# Altium project Z693_Test_JK08_V1.0.PrjPCB
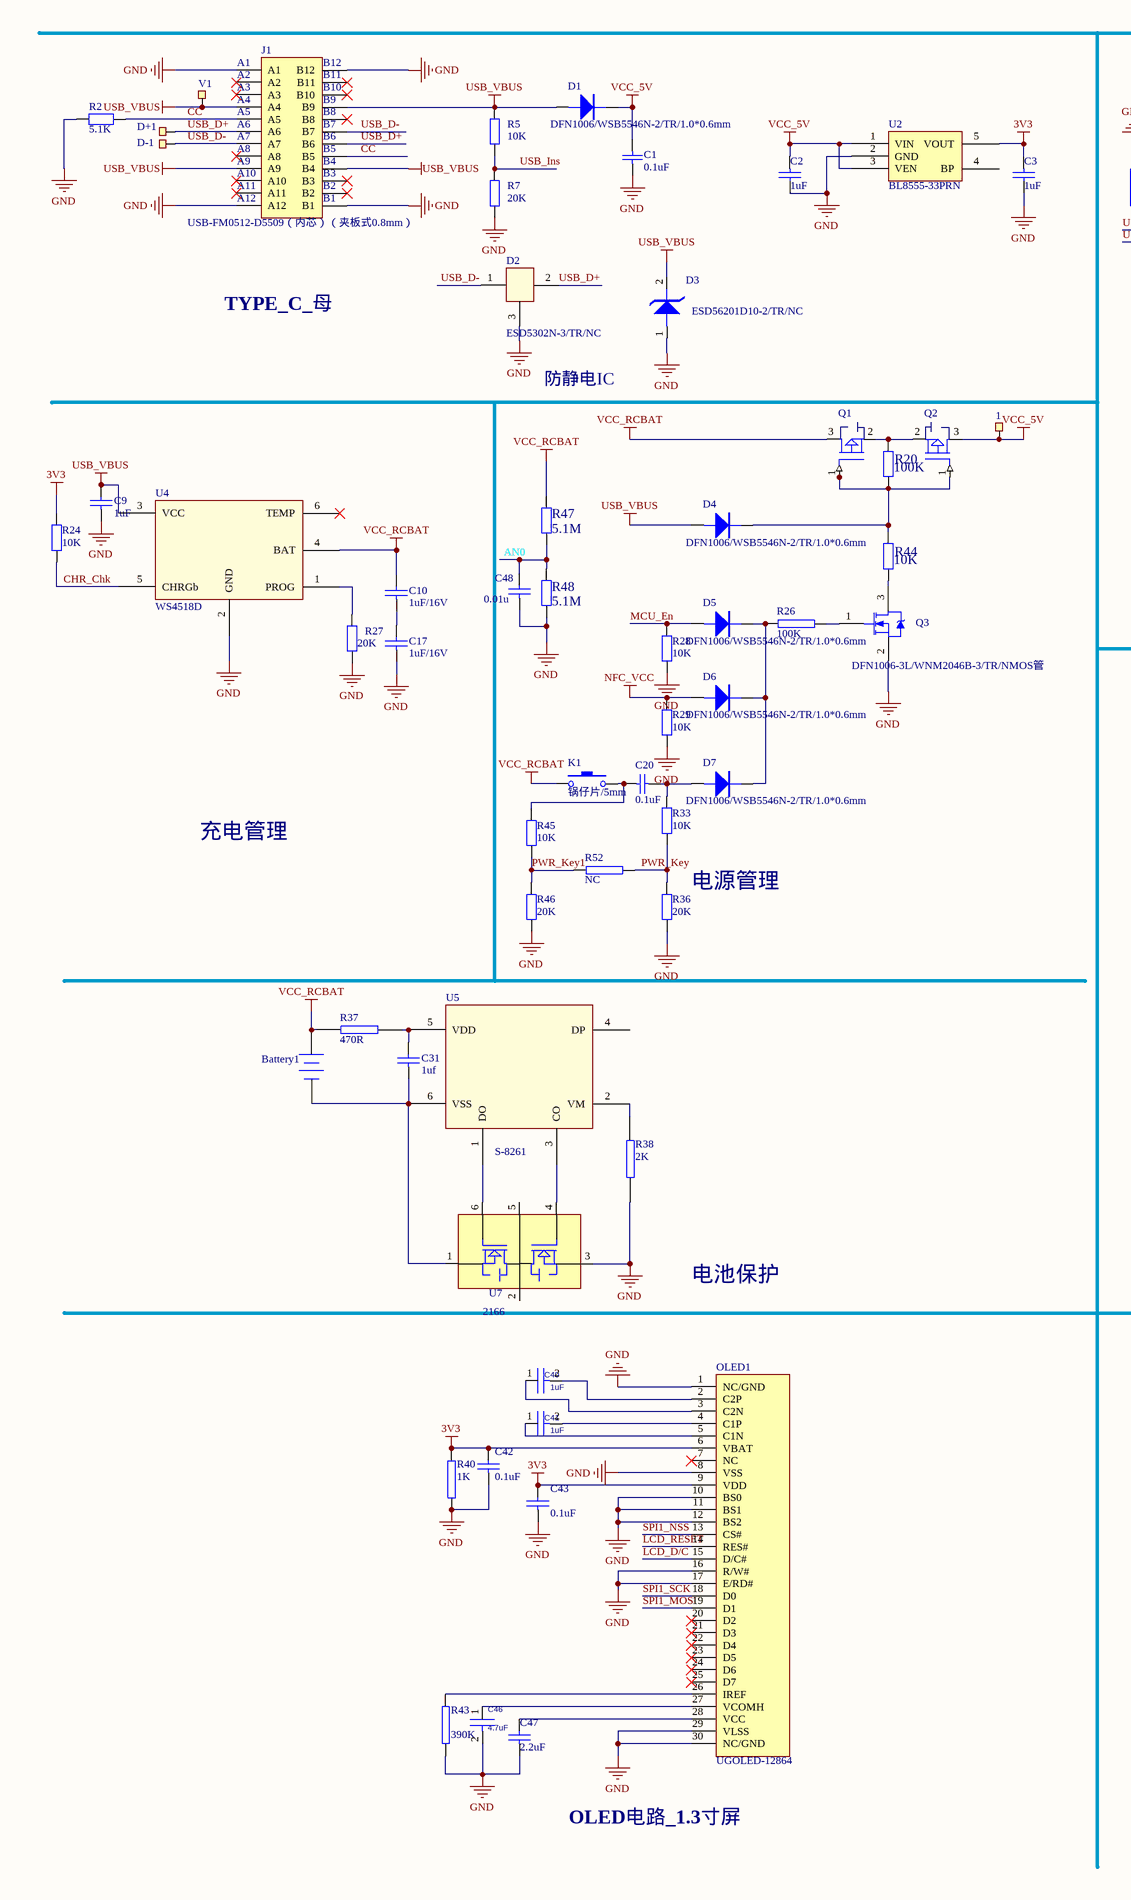
[diagram p0: Z693_Test_JK08_V1.0.SchDoc, left]
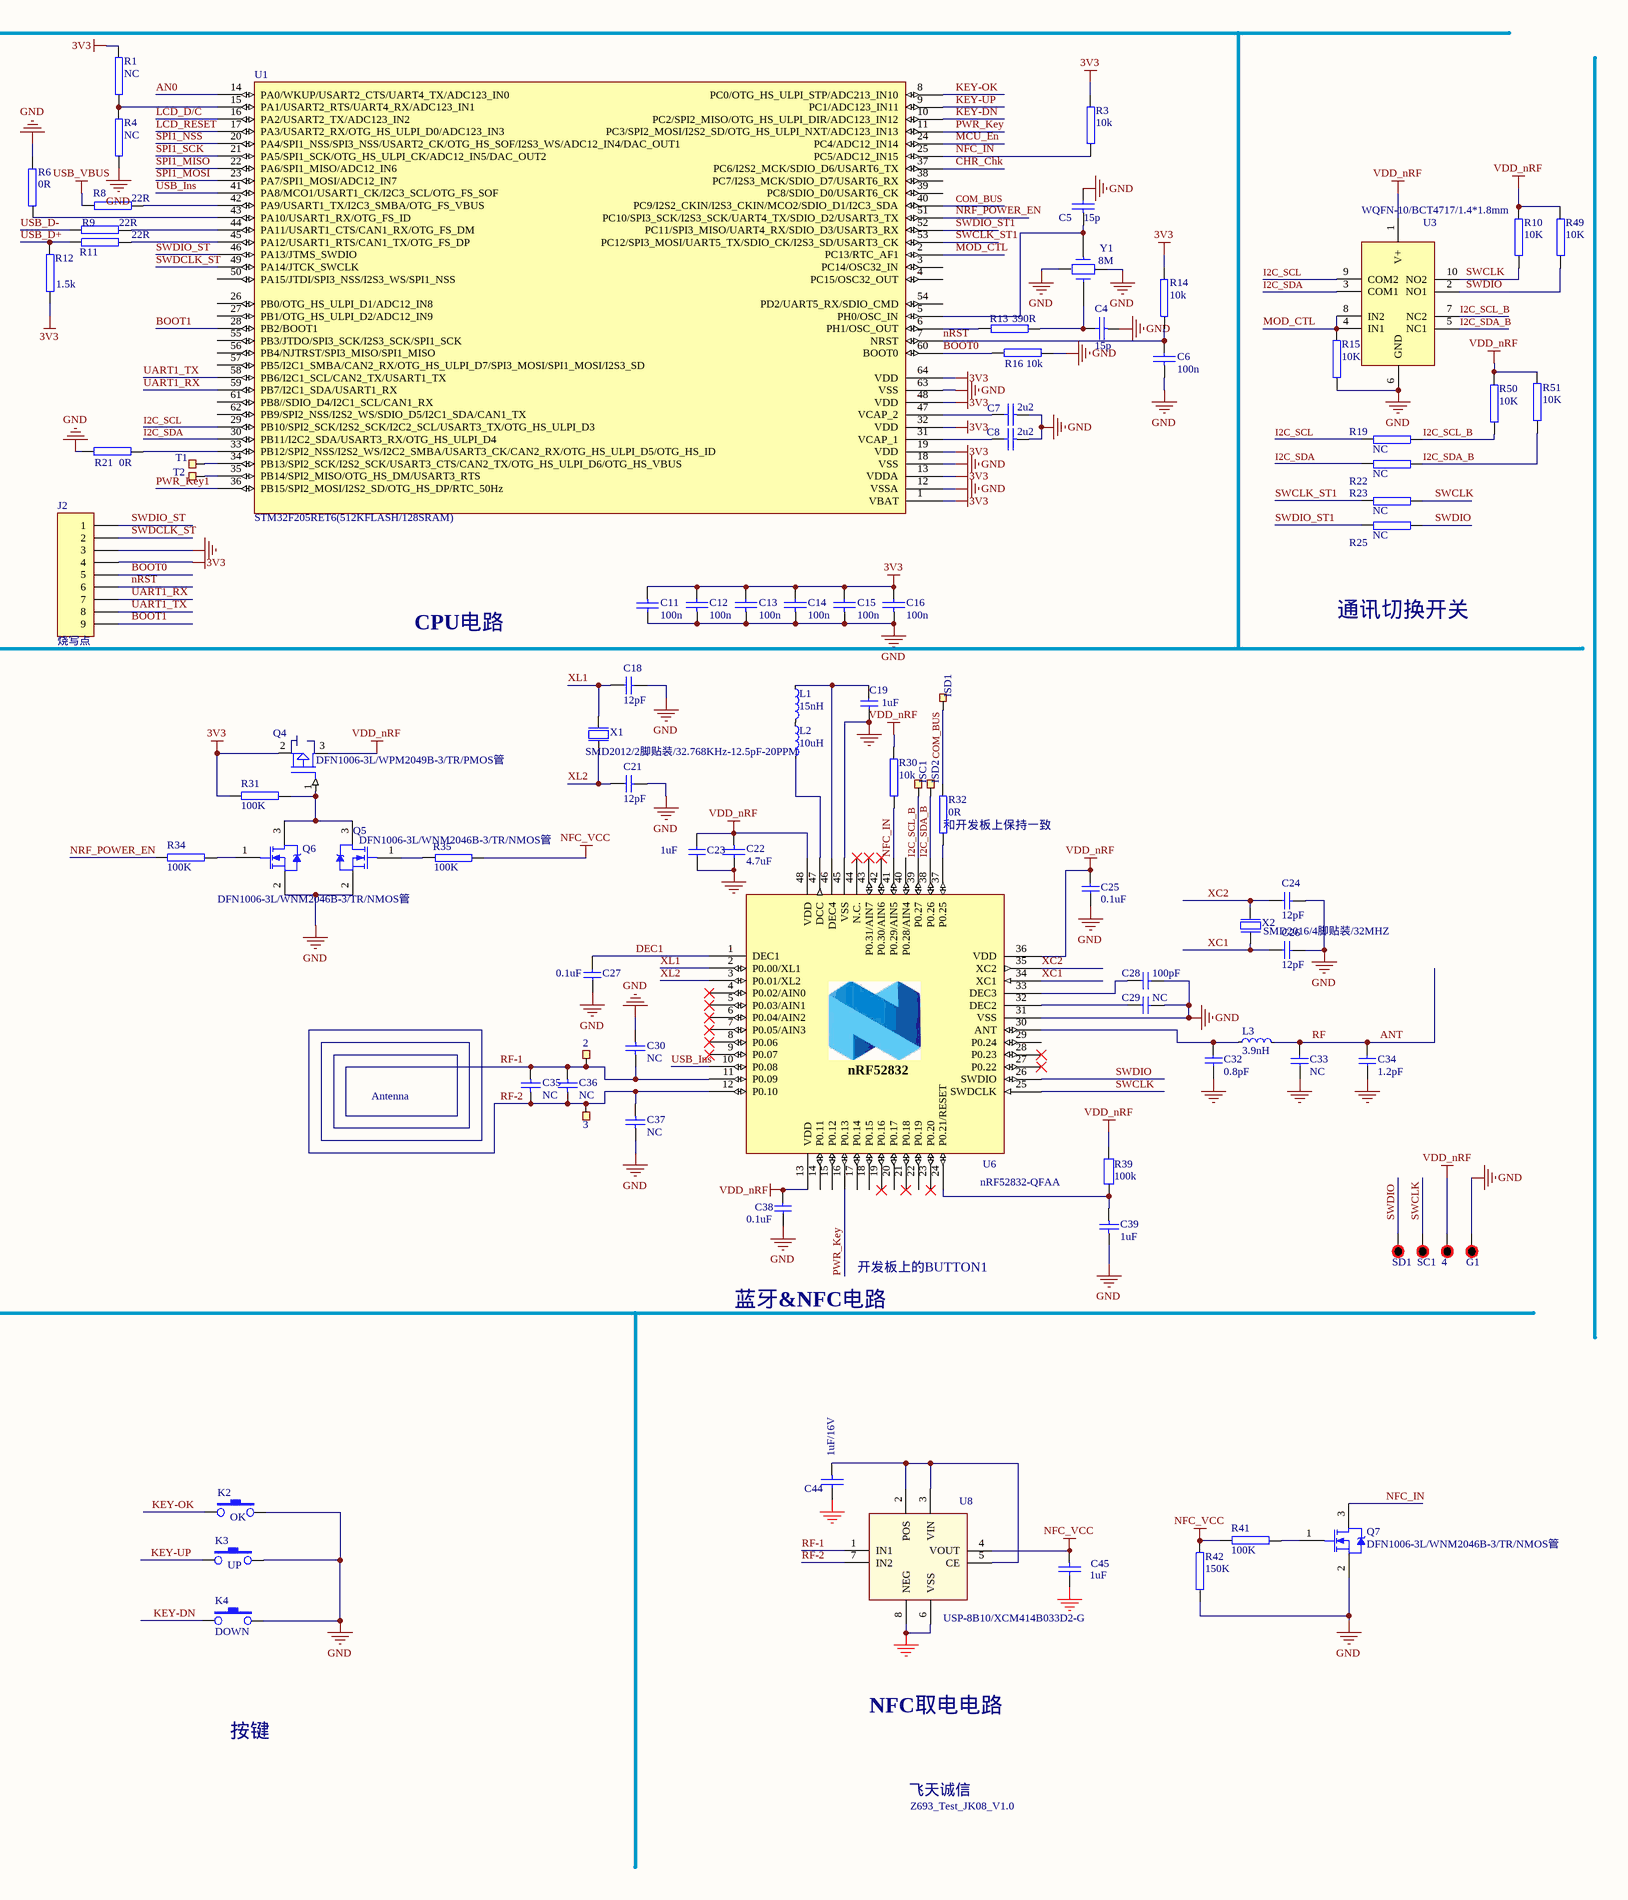
[diagram p1: Z693_Test_JK08_V1.0.SchDoc, right]
1 sheet, 150 parts. Net scope: global (net labels, ports and power ports of the same name join across sheets).
Board file: Z693_Test_JK08_V1.0.PcbDoc

## Sheet Z693_Test_JK08_V1.0.SchDoc
size A2

### Parts
1  (no value)  [FT_TEST_1]
2  (no value)  [FT_TEST_1]
3  (no value)  [FT_TEST_1]
4  (no value)  [FT_TEST_1]
Battery1  Battery  [FT_CELL]  (value not drawn)
C1  0.1uF  [FT_0402]
C2  1uF  [FT_0402]
C3  1uF  [FT_0402]
C4  15p  [FT_0402]
C5  15p  [FT_0402]
C6  100n  [FT_0402]
C7  2u2  [FT_0603]
C8  2u2  [FT_0603]
C9  1uF  [FT_0402]
C10  1uF/16V  [FT_0402]
C11  100n  [FT_0402]
C12  100n  [FT_0402]
C13  100n  [FT_0402]
C14  100n  [FT_0402]
C15  100n  [FT_0402]
C16  100n  [FT_0402]
C17  1uF/16V  [FT_0402]
C18  12pF  [FT_0402]
C19  1uF  [FT_0402]
C20  0.1uF  [FT_0402]
C21  12pF  [FT_0402]
C22  4.7uF  [FT_0402]
C23  1uF  [FT_0402]
C24  12pF  [FT_0402]
C25  0.1uF  [FT_0402]
C26  12pF  [FT_0402]
C27  0.1uF  [FT_0402]
C28  100pF  [FT_0402]
C29  NC  [FT_0402]
C30  NC  [FT_0402]
C31  1uf  [FT_0402]
C32  0.8pF  [FT_0402]
C33  NC  [FT_0402]
C34  1.2pF  [FT_0402]
C35  NC  [FT_0402]
C36  NC  [FT_0402]
C37  NC  [FT_0402]
C38  0.1uF  [FT_0402]
C39  1uF  [FT_0402]
C40  1uF  [FT_0402]
C41  1uF  [FT_0402]
C42  0.1uF  [FT_0402]
C43  0.1uF  [FT_0402]
C44  1uF/16V  [FT_0402]
C45  1uF  [FT_0402]
C46  4.7uF  [FT_0805]
C47  2.2uF  [FT_0603]
C48  0.01u  [FT_0402]
D1  DFN1006/WSB5546N-2/TR/1.0*0.6mm  [WSB5546N]
D2  ESD5302N-3/TR/NC  [FT_DFN1006-3L]
D3  ESD56201D10-2/TR/NC  [DFN1610]
D4  DFN1006/WSB5546N-2/TR/1.0*0.6mm  [WSB5546N]
D5  DFN1006/WSB5546N-2/TR/1.0*0.6mm  [WSB5546N]
D6  DFN1006/WSB5546N-2/TR/1.0*0.6mm  [WSB5546N]
D7  DFN1006/WSB5546N-2/TR/1.0*0.6mm  [WSB5546N]
D+1  (no value)  [FT_TEST_1]
D-1  (no value)  [FT_TEST_1]
G1  (no value)  [FT_TEST_1]
ISC1  (no value)  [FT_TEST_1]
ISD1  (no value)  [FT_TEST_1]
ISD2  (no value)  [FT_TEST_1]
J1  USB-FM0512-D5509（内芯）（夹板式0.8mm）  [FM0512-D5509]
J2  烧写点  [FT_SIP_9]
K1  锅仔片/5mm  [FT_BUTTON_5mm]
K2  OK  [FT_BUTTON_5mm]
K3  UP  [FT_BUTTON_5mm]
K4  DOWN  [FT_BUTTON_5mm]
L1  15nH  [FT_0402]
L2  10uH  [FT_0402]
L3  3.9nH  [FT_0402]
OLED1  UGOLED-12864  [OLED_PIN30]
Q1  DFN1006-3L/WPM2049B-3/TR/PMOS管  [FT_DFN1006-3L]  (value not drawn)
Q2  DFN1006-3L/WPM2049B-3/TR/PMOS管  [FT_DFN1006-3L]  (value not drawn)
Q3  DFN1006-3L/WNM2046B-3/TR/NMOS管  [FT_DFN1006-3L]
Q4  DFN1006-3L/WPM2049B-3/TR/PMOS管  [FT_DFN1006-3L]
Q5  DFN1006-3L/WNM2046B-3/TR/NMOS管  [FT_DFN1006-3L]
Q6  DFN1006-3L/WNM2046B-3/TR/NMOS管  [FT_DFN1006-3L]
Q7  DFN1006-3L/WNM2046B-3/TR/NMOS管  [FT_DFN1006-3L]
R1  NC  [FT_0402]
R2  5.1K  [FT_0402]
R3  10k  [FT_0402]
R4  NC  [FT_0402]
R5  10K  [FT_0402]
R6  0R  [FT_0402]
R7  20K  [FT_0402]
R8  22R  [FT_0402]
R9  22R  [FT_0402]
R10  10K  [FT_0402]
R11  22R  [FT_0402]
R12  1.5k  [FT_0402]
R13  390R  [FT_0402]
R14  10k  [FT_0402]
R15  10K  [FT_0402]
R16  10k  [FT_0402]
R19  NC  [FT_0402]
R20  100K  [FT_0402]
R21  0R  [FT_0402]
R22  NC  [FT_0402]
R23  NC  [FT_0402]
R24  10K  [FT_0402]
R25  NC  [FT_0402]
R26  100K  [FT_0402]
R27  20K  [FT_0402]
R28  10K  [FT_0402]
R29  10K  [FT_0402]
R30  10k  [FT_0402]
R31  100K  [FT_0402]
R32  0R  [FT_0402]
R33  10K  [FT_0402]
R34  100K  [FT_0402]
R35  100K  [FT_0402]
R36  20K  [FT_0402]
R37  470R  [FT_0402]
R38  2K  [FT_0402]
R39  100k  [FT_0402]
R40  1K  [FT_0402]
R41  100K  [FT_0402]
R42  150K  [FT_0402]
R43  390K  [FT_0402]
R44  10K  [FT_0402]
R45  10K  [FT_0402]
R46  20K  [FT_0402]
R47  5.1M  [FT_0402]
R48  5.1M  [FT_0402]
R49  10K  [FT_0402]
R50  10K  [FT_0402]
R51  10K  [FT_0402]
R52  NC  [FT_0402]
SC1  (no value)  [FT_TEST_1]
SD1  (no value)  [FT_TEST_1]
T1  (no value)  [FT_TEST_1]
T2  (no value)  [FT_TEST_1]
U1  STM32F205RET6(512KFLASH/128SRAM)  [TQFP64_N]
U2  BL8555-33PRN  [FT_SOT23_5]
U3  WQFN-10/BCT4717/1.4*1.8mm  [FT_WQFN_10]
U4  WS4518D  [FT_DFN2X2-6L]
U5  S-8261  [SOT26A-6L]
U6  nRF52832-QFAA  [QFN48N]
U7  2166  [SOT26A-6L]
U8  USP-8B10/XCM414B033D2-G  [XCM414-USP-8B10]
V1  (no value)  [FT_TEST_1]
X1  SMD2012/2脚贴装/32.768KHz-12.5pF-20PPM  [FT_OSC_32.768M_SMD_2]
X2  SMD2016/4脚贴装/32MHZ  [XTAL_16M]
Y1  8M  [FT_OSC_4-3225]
Z693_Test_JK08_V1.0  Z693_Text_JK08_V1.0  [FT_LOGO_300_Y]  (value not drawn)

### Nets
3V3: C3.1 C11.1 C12.2 C13.2 C14.2 C15.2 C16.2 C42.2 C43.2 J2.4 OLED1.6(VBAT) OLED1.9(VDD) Q4.2(S) R1.1 R3.1 R12.2 R14.2 R24.1 R31.2 R40.2 U1.1(VBAT) U1.13(VDDA) U1.19(VDD) U1.32(VDD) U1.48(VDD) U1.64(VDD) U2.5(VOUT)
GND: C1.2 C2.2 C3.2 C4.1 C5.2 C6.1 C7.1 C8.1 C9.1 C11.2 C12.1 C13.1 C14.1 C15.1 C16.1 C17.1 C18.2 C19.1 C21.2 C22.2 C23.2 C24.2 C25.2 C26.2 C27.2 C28.2 C29.2 C30.1 C32.1 C33.2 C34.2 C37.2 C38.2 C39.2 C42.1 C43.1 C44.2 C45.2 C46.2 C47.1 C48.1 D2.3 D3.1 G1.1 J1.A1 J1.A12 J1.B1 J1.B12 J2.3 K2.2 K3.2 K4.2 OLED1.1(NC/GND) OLED1.8(VSS) OLED1.10(BS0) OLED1.11(BS1) OLED1.12(BS2) OLED1.16(R/W#) OLED1.17(E/RD#) OLED1.29(VLSS) OLED1.30(NC/GND) Q3.2(S) Q5.2(S) Q6.2(S) Q7.2(S) R2.2 R4.2 R6.2 R7.1 R15.2 R16.1 R21.2 R27.1 R28.2 R29.1 R36.1 R38.2 R40.1 R42.1 R43.2 R46.1 R48.1 U1.12(VSSA) U1.18(VSS) U1.63(VSS) U2.2(GND) U3.6(GND) U4.2(GND) U6.31(VSS) U6.45(VSS) U6.49(GND) U7.3(S) U8.6(VSS) U8.8(NEG) X2.2(GND) X2.4(GND) Y1.2 Y1.4
NFC_VCC: C45.1 D6.1 R29.2 R35.2 R41.2 R42.2 U8.4(VOUT)
USB_VBUS: C9.2 D1.1 D3.2 D4.1 J1.A4 J1.A9 J1.B4 J1.B9 R5.2 R8.1 U4.3(VCC) V1.1
VCC_5V: 1.1 C1.1 C2.1 D1.2 Q2.3(D) U2.1(VIN) U2.3(VEN)
VCC_RCBAT: Battery1.1(+) C10.2 K1.2 Q1.3(D) R37.2 R47.2 U4.4(BAT)
VDD_nRF: 4.1 C22.1 C23.1 C25.1 C38.1 Q4.3(D) R10.1 R30.1 R39.2 R49.1 R50.1 R51.1 U3.1(V+) U6.13(VDD) U6.36(VDD) U6.48(VDD)
AN0: C48.2 R47.1 R48.2 U1.14(PA0/WKUP/USART2_CTS/UART4_TX/ADC123_IN0)
ANT: C33.1 C34.1 L3.2  [also labelled RF]
BOOT0: J2.5 R16.2 U1.60(BOOT0)
BOOT1: J2.9 U1.28(PB2/BOOT1)
CC: J1.A5 J1.B5 R2.1
CHR_Chk: R24.2 U1.37(PC6/I2S2_MCK/SDIO_D6/USART6_TX) U4.5(CHRGb)
COM_BUS: ISD1.1 R32.1 U1.40(PC9/I2S2_CKIN/I2S3_CKIN/MCO2/SDIO_D1/I2C3_SDA)
DEC1: C27.1 U6.1(DEC1)
I2C_SCL: R19.1 U1.29(PB10/SPI2_SCK/I2S2_SCK/I2C2_SCL/USART3_TX/OTG_HS_ULPI_D3) U3.9(COM2)
I2C_SCL_B: ISC1.1 R19.2 R50.2 U3.7(NC2) U6.39(P0.27)
I2C_SDA: R22.1 U1.30(PB11/I2C2_SDA/USART3_RX/OTG_HS_ULPI_D4) U3.3(COM1)
I2C_SDA_B: ISD2.1 R22.2 R51.2 U3.5(NC1) U6.38(P0.26)
KEY-DN: K4.1 U1.10(PC2/SPI2_MISO/OTG_HS_ULPI_DIR/ADC123_IN12)
KEY-OK: K2.1 U1.8(PC0/OTG_HS_ULPI_STP/ADC213_IN10)
KEY-UP: K3.1 U1.9(PC1/ADC123_IN11)
LCD_D/C: OLED1.15(D/C#) U1.16(PA2/USART2_TX/ADC123_IN2)
LCD_RESET: OLED1.14(RES#) U1.17(PA3/USART2_RX/OTG_HS_ULPI_D0/ADC123_IN3)
MCU_En: D5.1 R28.1 U1.24(PC4/ADC12_IN14)
MOD_CTL: R15.1 U1.2(PC13/RTC_AF1) U3.4(IN1) U3.8(IN2)
NFC_IN: Q7.3(D) R3.2 R30.2 U1.25(PC5/ADC12_IN15) U6.41(P0.29/AIN5)
NRF_POWER_EN: R34.2 U1.51(PC10/SPI3_SCK/I2S3_SCK/UART4_TX/SDIO_D2/USART3_TX)
nRST: C6.2 J2.6 R14.1 U1.7(NRST)
PWR_Key: R33.1 R36.2 R52.2 U1.11(PC3/SPI2_MOSI/I2S2_SD/OTG_HS_ULPI_NXT/ADC123_IN13) U6.16(P0.13)
PWR_Key1: R45.1 R46.2 R52.1 U1.36(PB15/SPI2_MOSI/I2S2_SD/OTG_HS_DP/RTC_50Hz)
RF-1: 2.1 3.1 C30.2 C35.1 C35.2 C36.1 C36.2 C37.1 U6.11(P0.09) U6.12(P0.10) U8.1(IN1) U8.7(IN2)  [also labelled RF-2]
SPI1_MISO: U1.22(PA6/SPI1_MISO/ADC12_IN6)
SPI1_MOSI: OLED1.19(D1) U1.23(PA7/SPI1_MOSI/ADC12_IN7)
SPI1_NSS: OLED1.13(CS#) U1.20(PA4/SPI1_NSS/SPI3_NSS/USART2_CK/OTG_HS_SOF/I2S3_WS/ADC12_IN4/DAC_OUT1)
SPI1_SCK: OLED1.18(D0) U1.21(PA5/SPI1_SCK/OTG_HS_ULPI_CK/ADC12_IN5/DAC_OUT2)
SWCLK: R10.2 R23.2 SC1.1 U3.10(NO2) U6.25(SWDCLK)
SWCLK_ST1: R23.1 U1.53(PC12/SPI3_MOSI/UART5_TX/SDIO_CK/I2S3_SD/USART3_CK)
SWDCLK_ST: J2.2 U1.49(PA14/JTCK_SWCLK)
SWDIO: R25.2 R49.2 SD1.1 U3.2(NO1) U6.26(SWDIO)
SWDIO_ST: J2.1 U1.46(PA13/JTMS_SWDIO)
SWDIO_ST1: R25.1 U1.52(PC11/SPI3_MISO/UART4_RX/SDIO_D3/USART3_RX)
UART1_RX: J2.7 U1.59(PB7/I2C1_SDA/USART1_RX)
UART1_TX: J2.8 U1.58(PB6/I2C1_SCL/CAN2_TX/USART1_TX)
USB_D+: D2.2 D+1.1 J1.A6 J1.B6 R11.2 R12.1
USB_D-: D2.1 D-1.1 J1.A7 J1.B7 R9.2
USB_Ins: R5.1 R7.2 U1.41(PA8/MCO1/USART1_CK/I2C3_SCL/OTG_FS_SOF) U6.10(P0.08)
XC1: C26.1 U6.34(XC1) X2.3(out)
XC2: C24.1 U6.35(XC2) X2.1(inp)
XL1: C18.1 U6.2(P0.00/XL1) X1.1(inp)
XL2: C21.1 U6.3(P0.01/XL2) X1.2(out)
NetBattery1_2: Battery1.2(-) C31.1 U5.6(VSS) U7.1(S)
NetC4_2: C4.2 R13.2 Y1.3
NetC5_1: C5.1 U1.5(PH0/OSC_IN) Y1.1
NetC7_2: C7.2 U1.47(VCAP_2)
NetC8_2: C8.2 U1.31(VCAP_1)
NetC10_1: C10.1 C17.2
NetC19_2: C19.2 L1.1 U6.46(DEC4)
NetC20_1: C20.1 D7.1 R33.2
NetC20_2: C20.2 K1.1 R45.2
NetC28_1: C28.1 U6.33(DEC3)
NetC29_1: C29.1 U6.32(DEC2)
NetC31_2: C31.2 R37.1 U5.5(VDD)
NetC32_2: C32.2 L3.1 U6.30(ANT)
NetC39_1: C39.1 R39.1 U6.24(P0.21/RESET)
NetC40_1: C40.1 OLED1.3(C2N)
NetC40_2: C40.2 OLED1.2(C2P)
NetC41_1: C41.1 OLED1.5(C1N)
NetC41_2: C41.2 OLED1.4(C1P)
NetC44_1: C44.1 U8.2(POS) U8.3(VIN) U8.5(CE)
NetC46_1: C46.1 OLED1.27(VCOMH)
NetC47_2: C47.2 OLED1.28(VCC)
NetD4_2: D4.2 Q1.1(G) Q2.1(G) R20.1 R44.2
NetD5_2: D5.2 D6.2 D7.2 R26.2
NetL1_2: L1.2 L2.1
NetL2_2: L2.2 U6.47(DCC)
NetOLED1_26: OLED1.26(IREF) R43.1
NetQ1_2: Q1.2(S) Q2.2(S) R20.2
NetQ3_1: Q3.1(G) R26.1
NetQ3_3: Q3.3(D) R44.1
NetQ4_1: Q4.1(G) Q5.3(D) Q6.3(D) R31.1
NetQ5_1: Q5.1(G) R35.1
NetQ6_1: Q6.1(G) R34.1
NetQ7_1: Q7.1(G) R41.1
NetR1_2: R1.2 R4.1 U1.15(PA1/USART2_RTS/UART4_RX/ADC123_IN1)
NetR6_1: R6.1 U1.43(PA10/USART1_RX/OTG_FS_ID)
NetR8_2: R8.2 U1.42(PA9/USART1_TX/I2C3_SMBA/OTG_FS_VBUS)
NetR9_1: R9.1 U1.44(PA11/USART1_CTS/CAN1_RX/OTG_FS_DM)
NetR11_1: R11.1 U1.45(PA12/USART1_RTS/CAN1_TX/OTG_FS_DP)
NetR13_1: R13.1 U1.6(PH1/OSC_OUT)
NetR21_1: R21.1 U1.33(PB12/SPI2_NSS/I2S2_WS/I2C2_SMBA/USART3_CK/CAN2_RX/OTG_HS_ULPI_D5/OTG_HS_ID)
NetR27_2: R27.2 U4.1(PROG)
NetR32_2: R32.2 U6.37(P0.25)
NetR38_1: R38.1 U5.2(VM)
NetT1_1: T1.1 U1.34(PB13/SPI2_SCK/I2S2_SCK/USART3_CTS/CAN2_TX/OTG_HS_ULPI_D6/OTG_HS_VBUS)
NetT2_1: T2.1 U1.35(PB14/SPI2_MISO/OTG_HS_DM/USART3_RTS)
NetU5_1: U5.1(DO) U7.6(G)
NetU5_3: U5.3(CO) U7.4(G)

Not connected (* = marked no-connect by the designer): J1 A2* A3* A8* A10* A11* B2* B3* B8* B10* B11*; OLED1 7(NC)* 20(D2)* 21(D3)* 22(D4)* 23(D5)* 24(D6)* 25(D7)*; U1 3(PC14/OSC32_IN) 4(PC15/OSC32_OUT) 26(PB0/OTG_HS_ULPI_D1/ADC12_IN8) 27(PB1/OTG_HS_ULPI_D2/ADC12_IN9) 38(PC7/I2S3_MCK/SDIO_D7/USART6_RX) 39(PC8/SDIO_D0/USART6_CK) 50(PA15/JTDI/SPI3_NSS/I2S3_WS/SPI1_NSS) 54(PD2/UART5_RX/SDIO_CMD) 55(PB3/JTDO/SPI3_SCK/I2S3_SCK/SPI1_SCK) 56(PB4/NJTRST/SPI3_MISO/SPI1_MISO) 57(PB5/I2C1_SMBA/CAN2_RX/OTG_HS_ULPI_D7/SPI3_MOSI/SPI1_MOSI/I2S3_SD) 61(PB8//SDIO_D4/I2C1_SCL/CAN1_RX) 62(PB9/SPI2_NSS/I2S2_WS/SDIO_D5/I2C1_SDA/CAN1_TX); U2 4(BP); U4 6(TEMP)*; U5 4(DP); U6 4(P0.02/AIN0)* 5(P0.03/AIN1)* 6(P0.04/AIN2)* 7(P0.05/AIN3)* 8(P0.06)* 9(P0.07)* 14(P0.11) 15(P0.12) 17(P0.14) 18(P0.15) 19(P0.16)* 20(P0.17) 21(P0.18)* 22(P0.19) 23(P0.20)* 27(P0.22)* 28(P0.23)* 29(P0.24) 40(P0.28/AIN4) 42(P0.30/AIN6)* 43(P0.31/AIN7)* 44(N.C.)*; U7 2(D) 5(D)

### Notes on the sheet
- (near J1) A1
- (near J1) A2
- (near J1) A3
- (near J1) B10
- (near J1) B11
- (near J1) B12
- (near J1) A4
- (near J1) A5
- (near J1) A6
- (near J1) A7
- (near J1) A8
- (near J1) B5
- (near J1) B6
- (near J1) B7
- (near J1) B8
- (near J1) B9
- (near J1) A9
- (near J1) A10
- (near J1) A11
- (near J1) A12
- (near J1) B1
- (near J1) B2
- (near J1) B3
- (near J1) B4
- TYPE_C_母
- 防静电IC
- CPU电路
- 通讯切换开关
- (near R32) 和开发板上保持一致
- 充电管理
- (near R36) 电源管理
- Antenna
- 电池保护
- 蓝牙&NFC电路
- 开发板上的BUTTON1
- 按键
- NFC取电电路
- OLED电路_1.3寸屏
- (in symbol LOGO) 飞天诚信
- (in symbol nRF52832-QFAA) nRF52832

### Library data of the parts
1-3 D+1 D-1 ISC1 ISD1 ISD2 T1 T2 V1 = JC-1: JC-2; VAL: *; DEV: *; REF: *; TOL: *; DESIG: *; BOI: *; FAB: *; PUI: *; REV: *
4 G1 SC1 SD1 = TEST
Battery1 = Battery: Part Number: CR2032-1F2
C1 C20 C39 = Capacitor: CAP CER .1UF 16V 10% X7R 0603; Part Number: GRM188R71C104KA01D; Manufacturer: Murata Electronics North America; Supplier 1: Digi-Key; Supplier Part Number 1: 490-1532-2-ND; Manufacturer Part Number: GRM188R71C104KA01D
C2 C3 C9 C10 C17 C22 C31 C42 C43 C47 C48 = CAP: Capacitor
C4-C8 C11-C16 = cap: Capacitor
C18 C21 C24 C26 = CAP: Capacitor, NP0, ?%; Part Number: C0402-12p; Note: 50V; Artikkelnr Noca: 20029159; Artikkelnr Simpro: N.A.; Manufacturer: *; Manufacturer Part Number: *; Datasheet: *; LatestRevisionDate: 2011-05-11; Pin Count: 2; Publisher: Nordic Semiconductor; Published: 2009-05-08; Value: 12pF; Supplier: *; Supplier part number: *; 2nd source Supplier: *; 2nd source part number: *; Footprint Doc: 0402
C19 = C0603-1?: Capacitor, X7R, ?0%; Value: 1.0µF; Note: 16V; Artikkelnr Noca: 20039335; Artikkelnr Simpro: N.A.; Part Number: C0603-1?; Manufacturer: *; Manufacturer Part Number: *; Datasheet: *; LatestRevisionDate: 2013-06-05; Pin Count: 2; Publisher: Nordic Semiconductor; Published: 2009-05-08; Supplier: *; Supplier part number: *; 2nd source Supplier: *; 2nd source part number: *; Footprint Doc: 0603
C23 C27 = CAP: Capacitor, X5R, ?0%; Part Number: C0603-4?; Value: 4.7μF; Note: 6.3V; Artikkelnr Noca: 20069060; Artikkelnr Simpro: N.A.; Manufacturer: *; Manufacturer Part Number: *; Datasheet: *; LatestRevisionDate: 2009-11-23; Pin Count: 2; Publisher: Nordic Semiconductor; Published: 2009-05-08; Supplier: *; Supplier part number: *; 2nd source Supplier: *; 2nd source part number: *; Footprint Doc: 0603
C25 = CAP: Capacitor, X7R, ?0%; Part Number: C0402-1n0; Value: 1.0nF; Note: 50V; Artikkelnr Noca: 20039223; Artikkelnr Simpro: N.A.; Manufacturer: *; Manufacturer Part Number: *; Datasheet: *; LatestRevisionDate: 2009-11-23; Pin Count: 2; Publisher: Nordic Semiconductor; Published: 2009-05-08; Supplier: *; Supplier part number: *; 2nd source Supplier: *; 2nd source part number: *; Footprint Doc: 0402
C28 = CAP: Capacitor, X7R, ?0%; Part Number: C0402-47n; Value: 47nF; Note: Chip Cap 10%; Artikkelnr Noca: 20039389; Artikkelnr Simpro: N.A.; Manufacturer: *; Manufacturer Part Number: *; Datasheet: *; LatestRevisionDate: 2009-05-08; Pin Count: 2; Publisher: Nordic Semiconductor; Published: 2009-05-08; Supplier: *; Supplier part number: *; 2nd source Supplier: *; 2nd source part number: *; Footprint Doc: 0402
C29 = CAP: Capacitor, X7R, ?0%; Part Number: C0402-2n2; Value: 2.2nF; Note: 50V; Artikkelnr Noca: 20039221; Artikkelnr Simpro: N.A.; Manufacturer: *; Manufacturer Part Number: *; Datasheet: *; LatestRevisionDate: 2009-11-23; Pin Count: 2; Publisher: Nordic Semiconductor; Published: 2009-05-08; Supplier: *; Supplier part number: *; 2nd source Supplier: *; 2nd source part number: *; Footprint Doc: 0402
C30 C35-C37 = Cap: Capacitor; Value: 0.1uF; Published: 8-Jun-2000; LatestRevisionDate: 17-Jul-2002; LatestRevisionNote: Re-released for DXP Platform.; PackageReference: RAD-0.3; Publisher: Altium Limited
C32 = C0402-0.8p: Capacitor, NP0, ?%; Note: 50V; Artikkelnr Noca: 20029147; Artikkelnr Simpro: N.A.; Part Number: C0402-0.8p; Manufacturer: *; Manufacturer Part Number: *; Datasheet: *; LatestRevisionDate: 2012-11-21; Pin Count: 2; Publisher: Nordic Semiconductor; Published: 2009-05-08; Value: 0.8pF; Supplier: *; Supplier part number: *; 2nd source Supplier: *; 2nd source part number: *; Footprint Doc: 0402
C33 = C0402-N.C.: Not mounted; Value: N.C.; Note: Chip Cap; Artikkelnr Noca: N.A.; Part Number: C0402-N.C.; Manufacturer: *; Manufacturer Part Number: *; Datasheet: *; LatestRevisionDate: 2009-05-08; Pin Count: 2; Publisher: Nordic Semiconductor; Published: 2009-05-08; Supplier: *; Supplier part number: *; 2nd source Supplier: *; 2nd source part number: *; Footprint Doc: 0402; Artikkelnr Simpro: N.A.
C34 = C0402-1.2p: Capacitor, NP0, ?.1pF; Note: 50V; Artikkelnr Noca: 20029157; Artikkelnr Simpro: N.A.; Part Number: C0402-1.2p; Manufacturer: *; Manufacturer Part Number: *; Datasheet: *; LatestRevisionDate: 2011-05-11; Pin Count: 2; Publisher: Nordic Semiconductor; Published: 2009-05-08; Value: 1.2pF; Supplier: *; Supplier part number: *; 2nd source Supplier: *; 2nd source part number: *; Footprint Doc: 0402
C38 = CAP: Capacitor, X7R, ?0%; Part Number: C0402-100n; Value: 100nF; Note: 16V; Artikkelnr Noca: 20039200; Artikkelnr Simpro: N.A.; Manufacturer: *; Manufacturer Part Number: *; Datasheet: *; LatestRevisionDate: 2009-11-23; Pin Count: 2; Publisher: Nordic Semiconductor; Published: 2009-05-08; Supplier: *; Supplier part number: *; 2nd source Supplier: *; 2nd source part number: *; Footprint Doc: 0402
C40 C41 C46 = C_Dup1
C44 C45 = CAP_1: Capacitor
D1 D4-D7 = DIODE_1N4148
D2 U8 = Component_1
D3 = DIODE_WY
J1 = A7101
J2 = Header 9: Header, 9-Pin; LatestRevisionDate: 17-Jul-2002; LatestRevisionNote: Re-released for DXP Platform.; Publisher: Altium Limited
K1 = SW-PB-2P: SWITCH USE IN H6; Part Number: B3F-1052
K2-K4 = BUTTON
L1 = L0402-15n: Inductor, 320mA, ?%; Manufacturer: Taiyo Yuden; Manufacturer Part Number: HK100515NJ-T; 2nd source part number: 658-1328; Note: High frequency chip inductor ?0%; Artikkelnr Noca: 33029323; Artikkelnr Simpro: N.A.; Part Number: L0402-15n; LatestRevisionDate: 2012-09-19; Pin Count: 2; Publisher: Nordic Semiconductor; Published: 2010-07-12; Value: 15nH; Supplier: Digi-Key; Datasheet: http://www.yuden.co.jp/productdata/catalog/en/mlci04_e.pdf; Supplier part number: 587-1521-1-ND; 2nd source Supplier: Farnell; Footprint Doc: 0402
L2 = L0603-10?: Inductor, 80mA, ?0%; Manufacturer: Taiyo Yuden; Manufacturer Part Number: LBMF1608T100K; 2nd source part number: 178-6105; Value: 10µH; Note: LBMF1608T100K 10µH 80mA 0603; Artikkelnr Noca: 33029314; Artikkelnr Simpro: N.A.; Part Number: L0603-10?; Datasheet: http://www.yuden.co.jp/ut/product/pdf/elb2_e.pdf; LatestRevisionDate: 2012-09-19; Pin Count: 2; Publisher: Nordic Semiconductor; Published: 2010-02-24; Supplier: Digi-Key; Supplier part number: 587-1714-1-ND; 2nd source Supplier: Farnell; Footprint Doc: 0603
L3 = L0402-3n9: Inductor, 170mA, ?.1nH; Manufacturer: Murata; Manufacturer Part Number: LQP15MN3N9B02D; Note: High frequency chip inductor ?%; Artikkelnr Noca: 33029151; Artikkelnr Simpro: N.A.; Part Number: L0402-3n9; Datasheet: http://search.murata.co.jp/Ceramy/image/img/PDF/ENG/L0075S0084LQP15M.pdf; LatestRevisionDate: 2012-09-19; Pin Count: 2; Publisher: Nordic Semiconductor; Published: 2009-05-08; Value: 3.9nH; Supplier: Digi-Key; Supplier part number: 490-1131-1-ND; 2nd source Supplier: *; 2nd source part number: *; Footprint Doc: 0402
OLED1 = CON5: Connector
Q1 Q2 Q4 = SI2301
Q3 Q5-Q7 = NMOS-2: N-Channel Power MOSFET; Note: Pin 2 is electrically connected to pin 4.; Published: 8-Jun-2000; LatestRevisionDate: 17-Jul-2002; LatestRevisionNote: Re-released for DXP Platform.; DatasheetVersion: PD-9.814; PackageReference: TO-220AB; Publisher: Altium Limited; Code_JEDEC: TO-220-AB; ComponentLink1Description: Manufacturer Link; ComponentLink1URL: http://www.irf.com/
R1 R3 R4 R6 R8-R16 R19 R21-R23 R25 R26 R30-R32 R34 R35 R37 R38 R40-R43 R49-R52 = RES2
R2 = RC0603JR-071ML: RES 1.0M OHM 1/10W 5% 0402 SMD; Part Number: RC0402JR-071ML; Manufacturer: Yageo; Supplier 1: Digi-Key; Supplier Part Number 1: 311-1.0MGRDKR-ND; Manufacturer Part Number: RC0402JR-071ML
R5 R7 R24 R27-R29 R33 R36 R39 R45 R46 = Resistor: RES 1.0M OHM 1/10W 5% 0603 SMD; Part Number: RC0603JR-071ML; Manufacturer: Yageo; Supplier 1: Digi-Key; Supplier Part Number 1: 311-1.0MGRDKR-ND; Manufacturer Part Number: RC0603JR-071ML
R20 R44 R47 R48 = Resistor: RES 10K OHM 1/10W 5% 0603 SMD; Part Number: RC0603JR-0710KL; Manufacturer: Yageo; Supplier 1: Digi-Key; Supplier Part Number 1: 311-10KGRCT-ND; Manufacturer Part Number: RC0603JR-0710KL
U1 = STM32F205RxTx
U2 = 5TO3
U3 = SGM3717
U6 = nRF52832-QFAA: Multi-protocol Bluetooth Low Energy and 2.4GHz proprietary system-on-chip; Manufacturer: Nordic Semiconductor; Artikkelnr Noca: N.A.; Part Number: nRF52832-QFAA; Manufacturer Part Number: nRF52832-QFAA; Datasheet: *; LatestRevisionDate: 2014-11-26; Pin Count: 48; Publisher: Nordic Semiconductor; Published: 2014-11-26; Value: nRF52832-QFAA; Note: *; Supplier: Nordic Semiconductor; Supplier part number: *; 2nd source Supplier: *; 2nd source part number: *; Footprint Doc: QFN-48; Artikkelnr Simpro: N.A.
U7 = 8205S-3
X1 X2 = XTAL_4-pin_grounded: XTAL SMD 2520, 16MHz, 8pF, ?5ppm; Part Number: NX2520SA-16MHZ-STD-CSW-5; Manufacturer: NDK; Note: XTAL SMD 16.000MHz; Artikkelnr Noca: 22019192; Artikkelnr Simpro: N.A.; Manufacturer Part Number: NX2520SA-16MHZ-STD-CSW-5; Datasheet: http://www.ndk.com/images/products/catalog/c_NX2520SA-STD-CSW-5_e.pdf; LatestRevisionDate: 2012-06-15; Pin Count: 4; Publisher: Nordic Semiconductor; Published: 2012-06-15; Value: 16MHz; Supplier: Digi-Key; Supplier part number: 644-1169-1-ND; 2nd source Supplier: *; 2nd source part number: *; Footprint Doc: BT-XTAL_2520
Y1 = OSC_6
Z693_Test_JK08_V1.0 = LOGO